# EAGLE schematic Board LineFollower PAK Sultan (EAGLE 7.2.0)
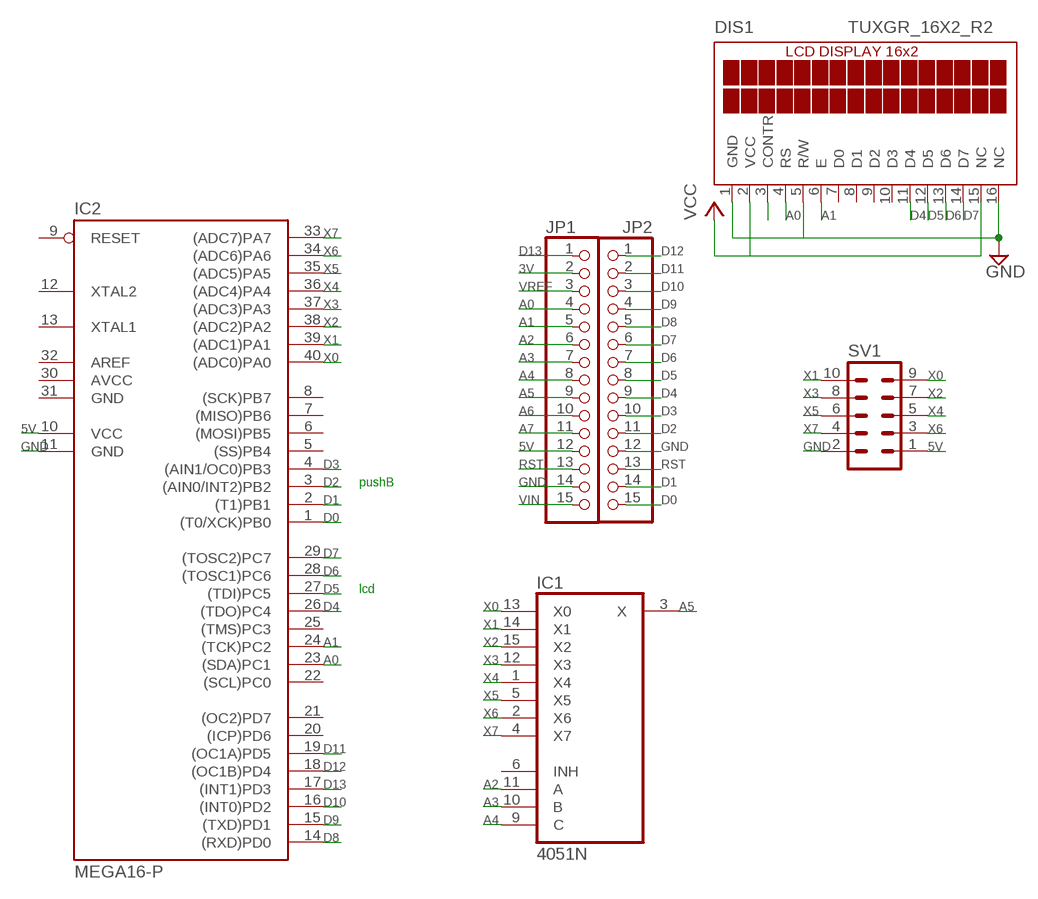
[diagram p0: schematic, sheet 1]

## Parts
DIS1  TUXGR_16X2_R2  [TUXGR_16X2_R2]
IC1  4051N  [DIL16]
IC2  MEGA16-P  [DIL40]
JP1  PINHD-1X15  [1X15]
JP2  PINHD-1X15  [1X15]
SV1  MA05-2  [MA05-2]

## Nets
3V: JP1.2
5V: IC2.10(VCC) JP1.12 SV1.1
A0: DIS1.4(RS) IC2.23((SDA)PC1) JP1.4
A1: DIS1.6(E) IC2.24((TCK)PC2) JP1.5
A2: IC1.11(A) JP1.6
A3: IC1.10(B) JP1.7
A4: IC1.9(C) JP1.8
A5: IC1.3(X) JP1.9
A6: JP1.10
A7: JP1.11
D0: IC2.1((T0/XCK)PB0) JP2.15
D1: IC2.2((T1)PB1) JP2.14
D2: IC2.3((AIN0/INT2)PB2) JP2.11
D3: IC2.4((AIN1/OC0)PB3) JP2.10
D4: DIS1.11(D4) IC2.26((TDO)PC4) JP2.9
D5: DIS1.12(D5) IC2.27((TDI)PC5) JP2.8
D6: DIS1.13(D6) IC2.28((TOSC1)PC6) JP2.7
D7: DIS1.14(D7) IC2.29((TOSC2)PC7) JP2.6
D8: IC2.14((RXD)PD0) JP2.5
D9: IC2.15((TXD)PD1) JP2.4
D10: IC2.16((INT0)PD2) JP2.3
D11: IC2.19((OC1A)PD5) JP2.2
D12: IC2.18((OC1B)PD4) JP2.1
D13: IC2.17((INT1)PD3) JP1.1
GND: DIS1.1(GND) DIS1.5(R/W) DIS1.16(NC) IC2.11(GND) JP1.14 JP2.12 SV1.2
N$9: DIS1.3(CONTR)
RST: JP1.13 JP2.13
VCC: DIS1.2(VCC) DIS1.15(NC)
VIN: JP1.15
VREF: JP1.3
X0: IC1.13(X0) IC2.40((ADC0)PA0) SV1.9
X1: IC1.14(X1) IC2.39((ADC1)PA1) SV1.10
X2: IC1.15(X2) IC2.38((ADC2)PA2) SV1.7
X3: IC1.12(X3) IC2.37((ADC3)PA3) SV1.8
X4: IC1.1(X4) IC2.36((ADC4)PA4) SV1.5
X5: IC1.5(X5) IC2.35((ADC5)PA5) SV1.6
X6: IC1.2(X6) IC2.34((ADC6)PA6) SV1.3
X7: IC1.4(X7) IC2.33((ADC7)PA7) SV1.4
Unconnected: DIS1.7(D0) DIS1.8(D1) DIS1.9(D2) DIS1.10(D3) IC1.6(INH) IC2.5((SS)PB4) IC2.6((MOSI)PB5) IC2.7((MISO)PB6) IC2.8((SCK)PB7) IC2.9(RESET) IC2.12(XTAL2) IC2.13(XTAL1) IC2.20((ICP)PD6) IC2.21((OC2)PD7) IC2.22((SCL)PC0) IC2.25((TMS)PC3) IC2.32(AREF)

## Notes on the sheet
- pushB
- lcd

## Power pins joined to a net without a drawn wire
AVCC: IC2.30(AVCC)
GND: IC1.8(GND) IC2.31(GND)
VCC: IC1.16(VCC)
VEE: IC1.7(VEE)

## Library data of the parts
DIS1 = display-lcd:TUXGR_16X2_R2: Tuxgraphics LCD display 16x2 characters reflective, without background light Source: tuxgr_12x2_r2.pdf; OC_FARNELL: unknown; OC_NEWARK: unknown
IC1 = 40xx:4051: 8-channel ANALOG MULTIPLEXER
IC2 = atmel:MEGA16-P: MICROCONTROLLER 16 Kbytes FLASH 1 kbytes SRAM 512 bytes EEPROM USART 8-channel 10 bit ADC Source: avr.lbr; MPN: ATMEGA16-16PU; OC_FARNELL: 9171142; OC_NEWARK: 01M6885
JP1 JP2 = pinhead:PINHD-1X15: PIN HEADER
SV1 = con-lstb:MA05-2: PIN HEADER; OC_FARNELL: unknown; OC_NEWARK: unknown